# Altium schematic sheet 2017_CARTE_MOFSET.SchDoc
size A3
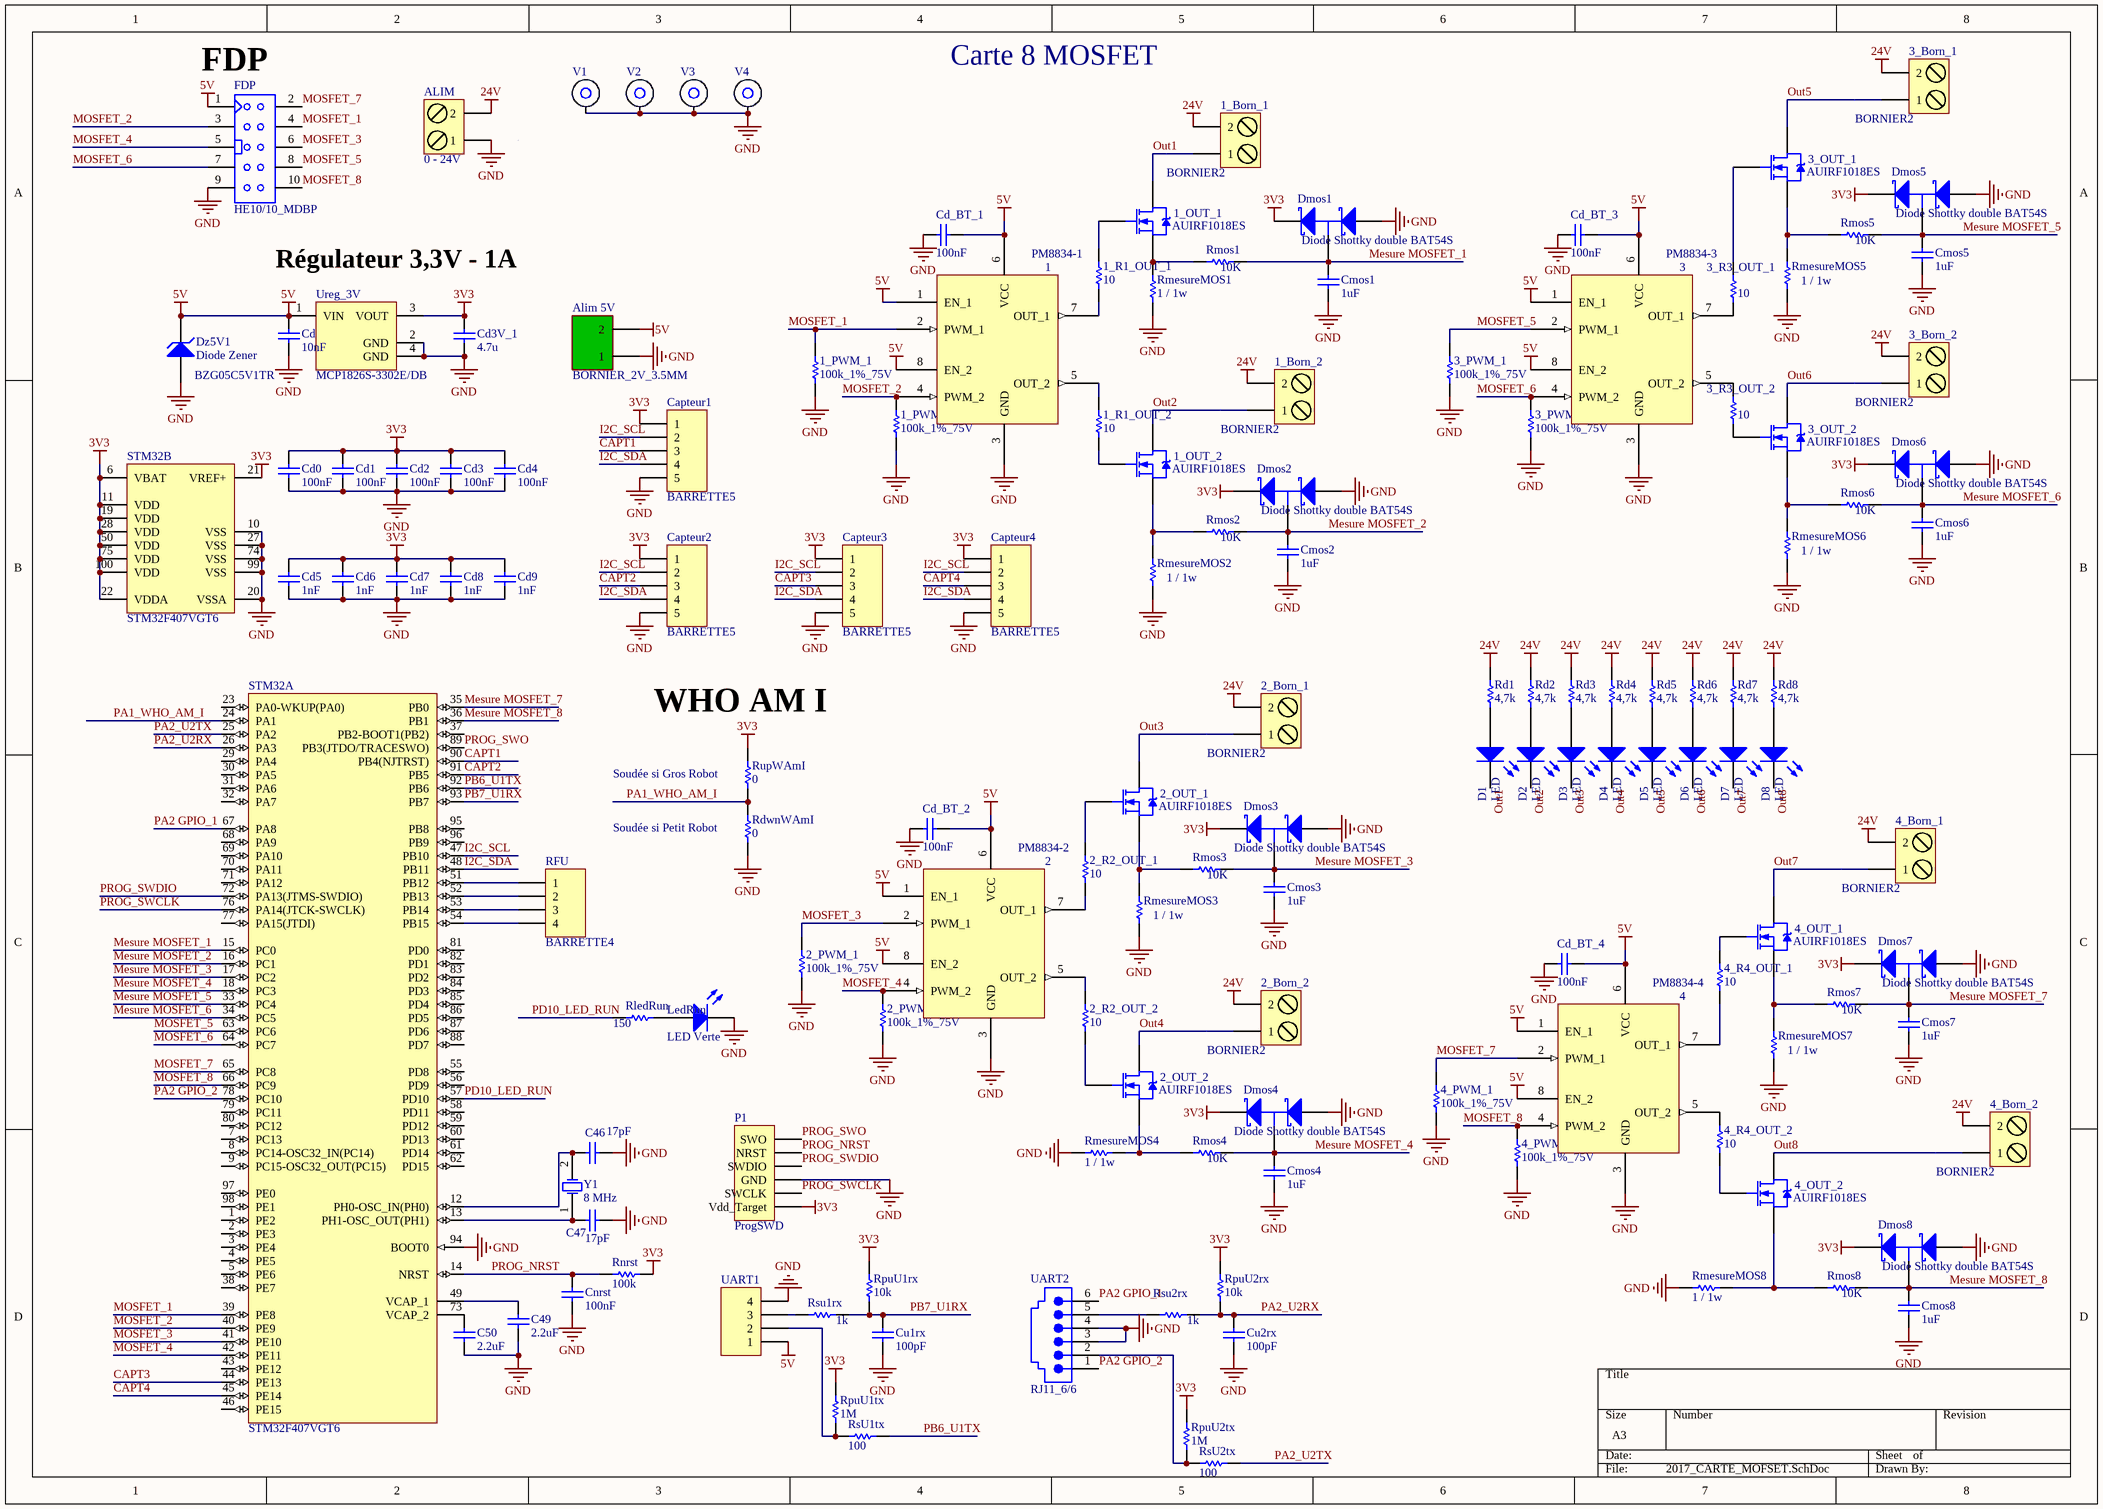
[diagram p0: 2017_CARTE_MOFSET.SchDoc]

## Parts
1  PM8834-1  [SO8_N]
1_Born_1  BORNIER2  [BORNIER2]
1_Born_2  BORNIER2  [BORNIER2]
1_OUT_1  AUIRF1018ES  [D2PAK_GROS_PAD]
1_OUT_2  AUIRF1018ES  [D2PAK_GROS_PAD]
1_PWM_1  100k_1%_75V  [R1206_N]
1_PWM_2  100k_1%_75V  [R1206_N]
1_R1_OUT_1  10  [R1206_N]
1_R1_OUT_2  10  [R1206_N]
2  PM8834-2  [SO8_N]
2_Born_1  BORNIER2  [BORNIER2]
2_Born_2  BORNIER2  [BORNIER2]
2_OUT_1  AUIRF1018ES  [D2PAK_GROS_PAD]
2_OUT_2  AUIRF1018ES  [D2PAK_GROS_PAD]
2_PWM_1  100k_1%_75V  [R1206_N]
2_PWM_2  100k_1%_75V  [R1206_N]
2_R2_OUT_1  10  [R1206_N]
2_R2_OUT_2  10  [R1206_N]
3  PM8834-3  [SO8_N]
3_Born_1  BORNIER2  [BORNIER2]
3_Born_2  BORNIER2  [BORNIER2]
3_OUT_1  AUIRF1018ES  [D2PAK_GROS_PAD]
3_OUT_2  AUIRF1018ES  [D2PAK_GROS_PAD]
3_PWM_1  100k_1%_75V  [R1206_N]
3_PWM_2  100k_1%_75V  [R1206_N]
3_R3_OUT_1  10  [R1206_N]
3_R3_OUT_2  10  [R1206_N]
4  PM8834-4  [SO8_N]
4_Born_1  BORNIER2  [BORNIER2]
4_Born_2  BORNIER2  [BORNIER2]
4_OUT_1  AUIRF1018ES  [D2PAK_GROS_PAD]
4_OUT_2  AUIRF1018ES  [D2PAK_GROS_PAD]
4_PWM_1  100k_1%_75V  [R1206_N]
4_PWM_2  100k_1%_75V  [R1206_N]
4_R4_OUT_1  10  [R1206_N]
4_R4_OUT_2  10  [R1206_N]
ALIM  0 - 24V  [BORNIER2_FEM_COUDE]
Alim_5V  BORNIER_2V_3.5MM  [BORNIER_2V_3.5MM]
C46  17pF  [C0805_N]
C47  17pF  [C0805_N]
C49  2.2uF  [C0805_N]
C50  2.2uF  [C0805_N]
Capteur1  BARRETTE5  [MOLEX5_2.50MM]
Capteur2  BARRETTE5  [MOLEX5_2.50MM]
Capteur3  BARRETTE5  [MOLEX5_2.50MM]
Capteur4  BARRETTE5  [MOLEX5_2.50MM]
Cd  10nF  [C1206_N]
Cd0  100nF  [C0805_N]
Cd1  100nF  [C0805_N]
Cd2  100nF  [C0805_N]
Cd3  100nF  [C0805_N]
Cd3V_1  4.7u  [C0805_N]
Cd4  100nF  [C0805_N]
Cd5  1nF  [C0805_N]
Cd6  1nF  [C0805_N]
Cd7  1nF  [C0805_N]
Cd8  1nF  [C0805_N]
Cd9  1nF  [C0805_N]
Cd_BT_1  100nF  [C0805_N]
Cd_BT_2  100nF  [C0805_N]
Cd_BT_3  100nF  [C0805_N]
Cd_BT_4  100nF  [C0805_N]
Cmos1  1uF  [C0805_N]
Cmos2  1uF  [C0805_N]
Cmos3  1uF  [C0805_N]
Cmos4  1uF  [C0805_N]
Cmos5  1uF  [C0805_N]
Cmos6  1uF  [C0805_N]
Cmos7  1uF  [C0805_N]
Cmos8  1uF  [C0805_N]
Cnrst  100nF  [C0805_N]
Cu1rx  100pF  [C0805_N]
Cu2rx  100pF  [C0805_N]
D1  LED  [LED_0805]
D2  LED  [LED_0805]
D3  LED  [LED_0805]
D4  LED  [LED_0805]
D5  LED  [LED_0805]
D6  LED  [LED_0805]
D7  LED  [LED_0805]
D8  LED  [LED_0805]
Dmos1  Diode Shottky double BAT54S  [SOT23-3N]
Dmos2  Diode Shottky double BAT54S  [SOT23-3N]
Dmos3  Diode Shottky double BAT54S  [SOT23-3N]
Dmos4  Diode Shottky double BAT54S  [SOT23-3N]
Dmos5  Diode Shottky double BAT54S  [SOT23-3N]
Dmos6  Diode Shottky double BAT54S  [SOT23-3N]
Dmos7  Diode Shottky double BAT54S  [SOT23-3N]
Dmos8  Diode Shottky double BAT54S  [SOT23-3N]
Dz5V1  Diode Zener  [SMA Diode]
FDP  Type: HE10/10_MDBP  [HE10/10_M_D_BP]  (hidden comment: HE10/10_MALE_DROIT_BAS_PROFIL)
LedRun  LED Verte  [LED_0805]
P1  ProgSWD  [HDR1X6]
Rd1  4,7k  [R1206_N]
Rd2  4,7k  [R1206_N]
Rd3  4,7k  [R1206_N]
Rd4  4,7k  [R1206_N]
Rd5  4,7k  [R1206_N]
Rd6  4,7k  [R1206_N]
Rd7  4,7k  [R1206_N]
Rd8  4,7k  [R1206_N]
RdwnWAmI  0  [R1206_N]
RFU  BARRETTE4  [HE14_4]
RledRun  150  [R1206_N]
RmesureMOS1  1 / 1w  [INDUCTANCE_CMS_1812]
RmesureMOS2  1 / 1w  [INDUCTANCE_CMS_1812]
RmesureMOS3  1 / 1w  [INDUCTANCE_CMS_1812]
RmesureMOS4  1 / 1w  [INDUCTANCE_CMS_1812]
RmesureMOS5  1 / 1w  [INDUCTANCE_CMS_1812]
RmesureMOS6  1 / 1w  [INDUCTANCE_CMS_1812]
RmesureMOS7  1 / 1w  [INDUCTANCE_CMS_1812]
RmesureMOS8  1 / 1w  [INDUCTANCE_CMS_1812]
Rmos1  10K  [R1206_N]
Rmos2  10K  [R1206_N]
Rmos3  10K  [R1206_N]
Rmos4  10K  [R1206_N]
Rmos5  10K  [R1206_N]
Rmos6  10K  [R1206_N]
Rmos7  10K  [R1206_N]
Rmos8  10K  [R1206_N]
Rnrst  100k  [R1206_N]
RpuU1rx  10k  [R1206_N]
RpuU1tx  1M  [R1206_N]
RpuU2rx  10k  [R1206_N]
RpuU2tx  1M  [R1206_N]
Rsu1rx  1k  [R1206_N]
RsU1tx  100  [R1206_N]
Rsu2rx  1k  [R1206_N]
RsU2tx  100  [R1206_N]
RupWAmI  0  [R1206_N]
STM32  STM32F407VGT6  [STM-LQFP100_N]  (parts A,B of 2)
UART1  BARRETTE4  [HDR1X4]  (value not drawn)
UART2  RJ11_6/6  [RJ11_6/6]
Ureg_3V  MCP1826S-3302E/DB  [SOT223-4N]
V1  Entretoise WURTH CMS  [ENTRETOISE_CMS]  (value not drawn)
V2  Entretoise WURTH CMS  [ENTRETOISE_CMS]  (value not drawn)
V3  Entretoise WURTH CMS  [ENTRETOISE_CMS]  (value not drawn)
V4  Entretoise WURTH CMS  [ENTRETOISE_CMS]  (value not drawn)
Y1  8 MHz  [HC49/4H_SMX]

## Nets
3V3: Capteur1.1 Capteur2.1 Capteur3.1 Capteur4.1 Cd0.2 Cd1.2 Cd2.2 Cd3.2 Cd3V_1.2 Cd4.2 Cd5.2 Cd6.2 Cd7.2 Cd8.2 Cd9.2 Dmos1.2(K) Dmos2.2(K) Dmos3.2(K) Dmos4.2(K) Dmos5.2(K) Dmos6.2(K) Dmos7.2(K) Dmos8.2(K) P1.1(Vdd_Target) Rnrst.2 RpuU1rx.2 RpuU1tx.2 RpuU2rx.2 RpuU2tx.2 RupWAmI.2 STM32.6(VBAT) STM32.11(VDD) STM32.19(VDD) STM32.21(VREF+) STM32.22(VDDA) STM32.28(VDD) STM32.50(VDD) STM32.75(VDD) STM32.100(VDD) Ureg_3V.3(VOUT)
5V: 1.1(EN_1) 1.6(VCC) 1.8(EN_2) 2.1(EN_1) 2.6(VCC) 2.8(EN_2) 3.1(EN_1) 3.6(VCC) 3.8(EN_2) 4.1(EN_1) 4.6(VCC) 4.8(EN_2) Alim_5V.2 Cd.2 Cd_BT_1.2 Cd_BT_2.2 Cd_BT_3.2 Cd_BT_4.2 Dz5V1.2(K) FDP.1 UART1.1 Ureg_3V.1(VIN)
24V: 1_Born_1.2 1_Born_2.2 2_Born_1.2 2_Born_2.2 3_Born_1.2 3_Born_2.2 4_Born_1.2 4_Born_2.2 ALIM.2 Rd1.1 Rd2.1 Rd3.1 Rd4.1 Rd5.1 Rd6.1 Rd7.1 Rd8.1
GND: 1.3(GND) 1_PWM_1.1 1_PWM_2.1 2.3(GND) 2_PWM_1.1 2_PWM_2.1 3.3(GND) 3_PWM_1.1 3_PWM_2.1 4.3(GND) 4_PWM_1.1 4_PWM_2.1 ALIM.1 Alim_5V.1 C46.1 C47.1 C49.1 C50.1 Capteur1.5 Capteur2.5 Capteur3.5 Capteur4.5 Cd.1 Cd0.1 Cd1.1 Cd2.1 Cd3.1 Cd3V_1.1 Cd4.1 Cd5.1 Cd6.1 Cd7.1 Cd8.1 Cd9.1 Cd_BT_1.1 Cd_BT_2.1 Cd_BT_3.1 Cd_BT_4.1 Cmos1.1 Cmos2.1 Cmos3.1 Cmos4.1 Cmos5.1 Cmos6.1 Cmos7.1 Cmos8.1 Cnrst.1 Cu1rx.1 Cu2rx.1 Dmos1.1(A) Dmos2.1(A) Dmos3.1(A) Dmos4.1(A) Dmos5.1(A) Dmos6.1(A) Dmos7.1(A) Dmos8.1(A) Dz5V1.1(A) FDP.9 LedRun.2(K) P1.3(GND) RdwnWAmI.1 RmesureMOS1.1 RmesureMOS2.1 RmesureMOS3.1 RmesureMOS4.2 RmesureMOS5.1 RmesureMOS6.1 RmesureMOS7.1 RmesureMOS8.2 STM32.10(VSS) STM32.20(VSSA) STM32.27(VSS) STM32.74(VSS) STM32.94(BOOT0) STM32.99(VSS) UART1.4 UART2.3 UART2.4 Ureg_3V.2(GND) Ureg_3V.4(GND) V1.1 V2.1 V3.1 V4.1
CAPT1: Capteur1.3 STM32.90(PB4(NJTRST))
CAPT2: Capteur2.3 STM32.91(PB5)
CAPT3: Capteur3.3 STM32.44(PE13)
CAPT4: Capteur4.3 STM32.45(PE14)
I2C_SCL: Capteur1.2 Capteur2.2 Capteur3.2 Capteur4.2 STM32.47(PB10)
I2C_SDA: Capteur1.4 Capteur2.4 Capteur3.4 Capteur4.4 STM32.48(PB11)
Mesure MOSFET_1: Cmos1.2 Dmos1.3(C) Rmos1.2 STM32.15(PC0)
Mesure MOSFET_2: Cmos2.2 Dmos2.3(C) Rmos2.2 STM32.16(PC1)
Mesure MOSFET_3: Cmos3.2 Dmos3.3(C) Rmos3.2 STM32.17(PC2)
Mesure MOSFET_4: Cmos4.2 Dmos4.3(C) Rmos4.2 STM32.18(PC3)
Mesure MOSFET_5: Cmos5.2 Dmos5.3(C) Rmos5.2 STM32.33(PC4)
Mesure MOSFET_6: Cmos6.2 Dmos6.3(C) Rmos6.2 STM32.34(PC5)
Mesure MOSFET_7: Cmos7.2 Dmos7.3(C) Rmos7.2 STM32.35(PB0)
Mesure MOSFET_8: Cmos8.2 Dmos8.3(C) Rmos8.2 STM32.36(PB1)
MOSFET_1: 1.2(PWM_1) 1_PWM_1.2 FDP.4 STM32.39(PE8)
MOSFET_2: 1.4(PWM_2) 1_PWM_2.2 FDP.3 STM32.40(PE9)
MOSFET_3: 2.2(PWM_1) 2_PWM_1.2 FDP.6 STM32.41(PE10)
MOSFET_4: 2.4(PWM_2) 2_PWM_2.2 FDP.5 STM32.42(PE11)
MOSFET_5: 3.2(PWM_1) 3_PWM_1.2 FDP.8 STM32.63(PC6)
MOSFET_6: 3.4(PWM_2) 3_PWM_2.2 FDP.7 STM32.64(PC7)
MOSFET_7: 4.2(PWM_1) 4_PWM_1.2 FDP.2 STM32.65(PC8)
MOSFET_8: 4.4(PWM_2) 4_PWM_2.2 FDP.10 STM32.66(PC9)
Out1: 1_Born_1.1 1_OUT_1.2(D) D1.2(K)
Out2: 1_Born_2.1 1_OUT_2.2(D) D2.2(K)
Out3: 2_Born_1.1 2_OUT_1.2(D) D3.2(K)
Out4: 2_Born_2.1 2_OUT_2.2(D) D4.2(K)
Out5: 3_Born_1.1 3_OUT_1.2(D) D5.2(K)
Out6: 3_Born_2.1 3_OUT_2.2(D) D6.2(K)
Out7: 4_Born_1.1 4_OUT_1.2(D) D7.2(K)
Out8: 4_Born_2.1 4_OUT_2.2(D) D8.2(K)
PA1_WHO_AM_I: RdwnWAmI.2 RupWAmI.1 STM32.24(PA1)
PA2 GPIO_1: STM32.67(PA8) UART2.6
PA2 GPIO_2: STM32.78(PC10) UART2.1
PA2_U2RX: Cu2rx.2 RpuU2rx.1 Rsu2rx.1 STM32.26(PA3)
PA2_U2TX: RsU2tx.2 STM32.25(PA2)
PB6_U1TX: RsU1tx.2 STM32.92(PB6)
PB7_U1RX: Cu1rx.2 RpuU1rx.1 Rsu1rx.1 STM32.93(PB7)
PD10_LED_RUN: RledRun.2 STM32.57(PD10)
PROG_NRST: Cnrst.2 P1.5(NRST) Rnrst.1 STM32.14(NRST)
PROG_SWCLK: P1.2(SWCLK) STM32.76(PA14(JTCK-SWCLK))
PROG_SWDIO: P1.4(SWDIO) STM32.72(PA13(JTMS-SWDIO))
PROG_SWO: P1.6(SWO) STM32.89(PB3(JTDO/TRACESWO))
Net1_5: 1.5(OUT_2) 1_R1_OUT_2.2
Net1_7: 1.7(OUT_1) 1_R1_OUT_1.1
Net1_OUT_1_1: 1_OUT_1.1(G) 1_R1_OUT_1.2
Net1_OUT_1_3: 1_OUT_1.3(S) RmesureMOS1.2 Rmos1.1
Net1_OUT_2_1: 1_OUT_2.1(G) 1_R1_OUT_2.1
Net1_OUT_2_3: 1_OUT_2.3(S) RmesureMOS2.2 Rmos2.1
Net2_5: 2.5(OUT_2) 2_R2_OUT_2.2
Net2_7: 2.7(OUT_1) 2_R2_OUT_1.1
Net2_OUT_1_1: 2_OUT_1.1(G) 2_R2_OUT_1.2
Net2_OUT_1_3: 2_OUT_1.3(S) RmesureMOS3.2 Rmos3.1
Net2_OUT_2_1: 2_OUT_2.1(G) 2_R2_OUT_2.1
Net2_OUT_2_3: 2_OUT_2.3(S) RmesureMOS4.1 Rmos4.1
Net3_5: 3.5(OUT_2) 3_R3_OUT_2.2
Net3_7: 3.7(OUT_1) 3_R3_OUT_1.1
Net3_OUT_1_1: 3_OUT_1.1(G) 3_R3_OUT_1.2
Net3_OUT_1_3: 3_OUT_1.3(S) RmesureMOS5.2 Rmos5.1
Net3_OUT_2_1: 3_OUT_2.1(G) 3_R3_OUT_2.1
Net3_OUT_2_3: 3_OUT_2.3(S) RmesureMOS6.2 Rmos6.1
Net4_5: 4.5(OUT_2) 4_R4_OUT_2.2
Net4_7: 4.7(OUT_1) 4_R4_OUT_1.1
Net4_OUT_1_1: 4_OUT_1.1(G) 4_R4_OUT_1.2
Net4_OUT_1_3: 4_OUT_1.3(S) RmesureMOS7.2 Rmos7.1
Net4_OUT_2_1: 4_OUT_2.1(G) 4_R4_OUT_2.1
Net4_OUT_2_3: 4_OUT_2.3(S) RmesureMOS8.1 Rmos8.1
NetC46_2: C46.2 STM32.12(PH0-OSC_IN(PH0)) Y1.2(OSC2)
NetC47_2: C47.2 STM32.13(PH1-OSC_OUT(PH1)) Y1.1(OSC1)
NetC49_2: C49.2 STM32.49(VCAP_1)
NetC50_2: C50.2 STM32.73(VCAP_2)
NetD1_1: D1.1(A) Rd1.2
NetD2_1: D2.1(A) Rd2.2
NetD3_1: D3.1(A) Rd3.2
NetD4_1: D4.1(A) Rd4.2
NetD5_1: D5.1(A) Rd5.2
NetD6_1: D6.1(A) Rd6.2
NetD7_1: D7.1(A) Rd7.2
NetD8_1: D8.1(A) Rd8.2
NetLedRun_1: LedRun.1(A) RledRun.1
NetRFU_1: RFU.1 STM32.51(PB12)
NetRFU_2: RFU.2 STM32.52(PB13)
NetRFU_3: RFU.3 STM32.53(PB14)
NetRFU_4: RFU.4 STM32.54(PB15)
NetRpuU1tx_1: RpuU1tx.1 RsU1tx.1 UART1.2
NetRpuU2tx_1: RpuU2tx.1 RsU2tx.1 UART2.2
NetRsu1rx_2: Rsu1rx.2 UART1.3
NetRsu2rx_2: Rsu2rx.2 UART2.5

Not connected (* = marked no-connect by the designer): STM32 1(PE2) 2(PE3) 3(PE4) 4(PE5) 5(PE6) 7(PC13) 8(PC14-OSC32_IN(PC14)) 9(PC15-OSC32_OUT(PC15)) 23(PA0-WKUP(PA0)) 29(PA4) 30(PA5) 31(PA6) 32(PA7) 37(PB2-BOOT1(PB2)) 38(PE7) 43(PE12) 46(PE15) 55(PD8) 56(PD9) 58(PD11) 59(PD12) 60(PD13) 61(PD14) 62(PD15) 68(PA9) 69(PA10) 70(PA11) 71(PA12) 77(PA15(JTDI)) 79(PC11) 80(PC12) 81(PD0) 82(PD1) 83(PD2) 84(PD3) 85(PD4) 86(PD5) 87(PD6) 88(PD7) 95(PB8) 96(PB9) 97(PE0) 98(PE1)

## Notes on the sheet
- (near FDP) FDP
- Carte 8 MOSFET
- Régulateur 3,3V - 1A
- (near RupWAmI) WHO AM I
- (near RupWAmI) Soudée si Gros Robot
- (near RdwnWAmI) Soudée si Petit Robot
- (in symbol Diode Zener) BZG05C5V1TR

## Library data of the parts
1-4 = PM8834: 4 A dual low-side MOSFET driver
1_Born_1 1_Born_2 2_Born_1 2_Born_2 3_Born_1 3_Born_2 4_Born_1 4_Born_2 ALIM = BORNIER2: Terminal blocks, 2 pins, pitch=5mm
1_OUT_1 1_OUT_2 2_OUT_1 2_OUT_2 3_OUT_1 3_OUT_2 4_OUT_1 4_OUT_2 = IRF1010S: HEXFET N-Channel Power MOSFET; Published: 8-Jun-2000; LatestRevisionDate: 17-Jul-2002; LatestRevisionNote: Re-released for DXP Platform.; DatasheetVersion: PD-9.923; PackageReference: D2PAK; Publisher: Altium Limited; PackageDescription: D2-PAK/TO-263-AB; 3 Leads (1 Cropped); Body 15.5 (inc. leads) x 10.5 mm (LxW max); ComponentLink1Description: Manufacturer Link; ComponentLink1URL: http://www.irf.com/; ComponentLink2Description: Datasheet; ComponentLink2URL: http://www.irf.com/product-info/datasheets/data/irf1010ns.pdf
1_PWM_1 1_PWM_2 2_PWM_1 2_PWM_2 3_PWM_1 3_PWM_2 4_PWM_1 4_PWM_2 = Resistor: FAR: 1469748; Published: 8-Jun-2000; LatestRevisionDate: 17-Jul-2002; LatestRevisionNote: Re-released for DXP Platform.; PackageReference: AXIAL-0.5; Publisher: Altium Limited
1_R1_OUT_1 1_R1_OUT_2 2_R2_OUT_1 2_R2_OUT_2 3_R3_OUT_1 3_R3_OUT_2 4_R4_OUT_1 4_R4_OUT_2 Rd1-Rd8 RdwnWAmI RledRun RmesureMOS1-RmesureMOS8 Rmos1-Rmos8 Rnrst RpuU1rx RpuU1tx RpuU2rx RpuU2tx Rsu1rx RsU1tx Rsu2rx RsU2tx RupWAmI = Resistor: Published: 8-Jun-2000; LatestRevisionDate: 17-Jul-2002; LatestRevisionNote: Re-released for DXP Platform.; PackageReference: AXIAL-0.5; Publisher: Altium Limited
C46 C47 C49 C50 Cd Cd0-Cd9 Cd_BT_1-Cd_BT_4 Cmos1-Cmos8 Cnrst Cu1rx Cu2rx = Condensateur: Capacitor; Published: 8-Jun-2000; LatestRevisionDate: 17-Jul-2002; LatestRevisionNote: Re-released for DXP Platform.; PackageReference: RAD-0.3; Publisher: Altium Limited
Capteur1-Capteur4 = BARRETTE5: Header, 5-Pin; LatestRevisionDate: 17-Jul-2002; LatestRevisionNote: Re-released for DXP Platform.; Publisher: Altium Limited
Cd3V_1 = Capacitor: Published: 8-Jun-2000; LatestRevisionDate: 17-Jul-2002; LatestRevisionNote: Re-released for DXP Platform.; PackageReference: RAD-0.3; Publisher: Altium Limited
D1-D8 LedRun = LED: Typical LED; Published: 8-Jun-2000; LatestRevisionDate: 08-Jul-2005; LatestRevisionNote: Mech Layer 1 removed.; PackageReference: LED-1; Publisher: Altium Limited
Dmos1-Dmos8 = Diode Shottky double BAT54S: DIODE SCHOTTKY DOUBLE; Manufacturer: ZETEX; ComponentLink1URL: http://www.farnell.com/datasheets/27632.pdf; ComponentLink1Description: http://www.farnell.com/datasheets/27632.pdf; Supplier: Farnell; RoHS: YES; Supplier Part Number: 9526510; Pricing: 5=0,32, 25=0,26, 100=0,21, 1000=0,17 (EUR); Manufacturer Part Number: BAT54S
Dz5V1 = Diode Zener: Zener Diode
FDP = HE10/10_MALE_DROIT_BAS_PROFIL: EMBASE HE10/10 MALE DROIT BAS PROFIL
P1 = Header 6: Header, 6-Pin; LatestRevisionDate: 17-Jul-2002; LatestRevisionNote: Re-released for DXP Platform.; Publisher: Altium Limited
RFU UART1 = BARRETTE4: Header, 4-Pin; LatestRevisionDate: 17-Jul-2002; LatestRevisionNote: Re-released for DXP Platform.; Publisher: Altium Limited
STM32 = STM32F407VGT6: ARM Cortex-M4 32-bit MCU+FPU, 210 DMIPS, 1024 kB Flash, 192 kB Internal RAM, 82 I/Os, 100-pin LQFP, -40 to 85 degC, Tray; Manufacturer: STMicroelectronics; D/A Converter: 2x12-bit; FLASH Size (Prog) (kB): 1024; I/Os (High Current): 82; Internal RAM Size (kB): 192; Operating Frequency(F) (Processor speed) (MHz): 168; Supply Voltage(Vcc) max (V): 3.6; Supply Voltage(Vcc) min (V): 1.8; DatasheetVersion: Rev. 4; PackageVersion: Rev. 1, 06/2013; PackageReference: LQFP100; PackageDescription: 100-Pin Low Profile Quad Flat Package, 14 x 14 mm Body, 0.5 mm Pitch; Supplier 1: Digi-Key; Supplier Part Number 1: 497-11605-ND; Supplier 2: Farnell; Supplier Part Number 2: 2064368; Supplier 3: Newark; Supplier Part Number 3: 73T2333; Supplier 4: Mouser; Supplier Part Number 4: 511-STM32F407VGT6; Core: ARM Cortex-M4; Packing: Tray; Mounting Technology: Surface Mount; PartNumber: STM32F407VGT6; ComponentLink1Description: Manufacturer URL; ComponentLink1URL: http://www.st.com/web/en/home.html; ComponentLink2Description: Datasheet; ComponentLink2URL: http://www.st.com/st-web-ui/static/active/en/resource/technical/document/datasheet/DM00037051.pdf; ComponentLink3Description: Package Specification; ComponentLink3URL: http://www.st.com/st-web-ui/static/active/en/resource/technical/document/data_brief/DM00071938.pdf
UART2 = RJ11_6/6: Right Angle, Standard Profile, Offset Latch DECconnect, Flangeless PCB Jack; Ports: 1; Positions/Loaded: Port1 - 6 Offset Latch/6; PerformanceCategory: 3; PCB_Mounting: Thru-Hole; DrillSize: Nominal, Rounded to nearest 0.05mm; PCB_Layout: Complies with Manufacturer's Recommendation.; Published: 25-Jun-2002; DatasheetDocument: 18-Dec-2001; PackageDocument: 18-Dec-2001; PackageReference: 15-43-6110; Publisher: Altium Limited; ComponentLink1Description: Manufacturer Link; ComponentLink1URL: http://www.molex.com/; ComponentLink2Description: Datasheet; ComponentLink2URL: http://www.molex.com/cmc_upload/common_files/1212003_41369catalogpage.pdf; Type: RJ11_6/6
Ureg_3V = MCP1826S-3302E/DB: 1000 mA, Low Voltage, Low Quiescent Current LDO Regulator, 3-Pin SOT-223, Extended Temperature; FirstPublished: 29-Jan-2009; DatasheetVersion: revA, Aug-2007; PackageVersion: revBB, Aug-2009; PackageReference: SOT-223-DB3; Publisher: Altium Limited; PackageDescription: 3-Lead Plastic Small Outline Transistor (DB) [SOT-223]; Supplier 1: Digi-Key; Supplier Part Number 1: MCP1826S-3302E/DB-ND; Supplier 2: Farnell; Supplier Part Number 2: 1578424; Supplier 3: Newark; Supplier Part Number 3: 27M0037; ComponentLink1Description: Datasheet; ComponentLink1URL: http://ww1.microchip.com/downloads/en/DeviceDoc/22057a.pdf; ComponentLink2Description: Packaging Specification; ComponentLink2URL: http://www.microchip.com/stellent/groups/techpub_sg/documents/packagingspec/en012702.pdf; ComponentLink3Description: Microchip.com Home; ComponentLink3URL: http://www.microchip.com/
V1-V4 = Entretoise WURTH CMS: Entretoise Wurth; Publisher: Damien Guitton
Y1 = Quartz: Crystal Oscillator; Published: 8-Jun-2000; LatestRevisionDate: 17-Jul-2002; LatestRevisionNote: Re-released for DXP Platform.; PackageReference: R38; Publisher: Altium Limited